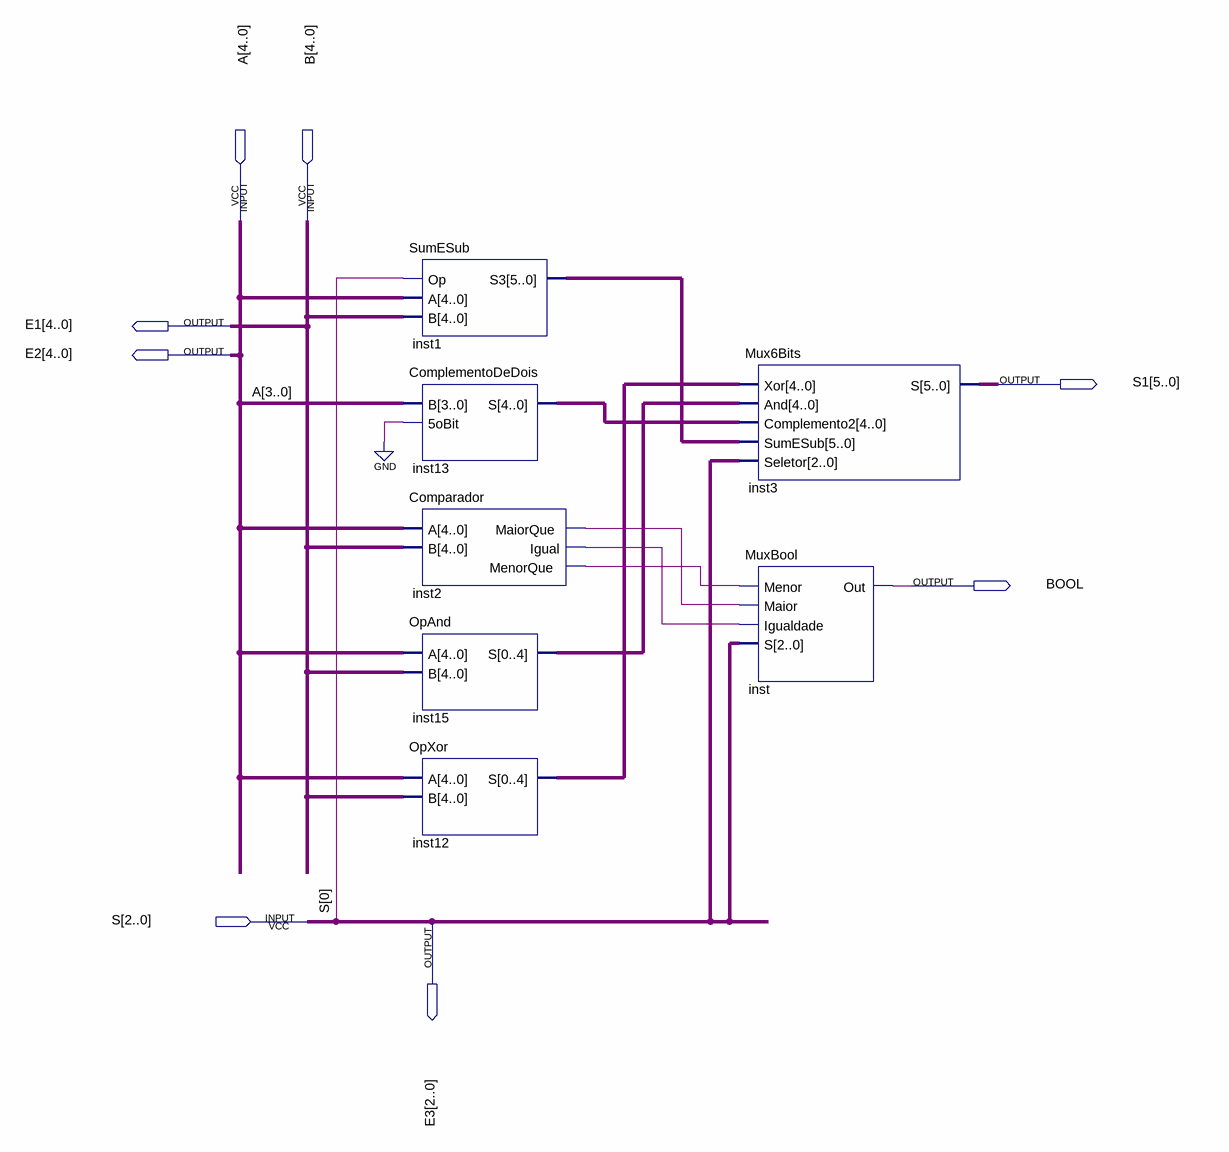
[diagram p0: schematic sheet]
// Quartus schematic Geral.bdf as structural Verilog: 7 symbols, 8 pins
module Geral (
  input  [4:0] A,
  input  [4:0] B,
  input  [2:0] S,
  output [4:0] E1,
  output [4:0] E2,
  output [5:0] S1,
  output BOOL,
  output [2:0] E3
);

  wire inst2_igual, inst2_maiorque, inst2_menorque;
  wire [4:0] inst12_s, inst13_s, inst15_s;
  wire [5:0] inst1_s3;

  SumESub inst1 (.Op(S[0]), .A(A), .B(B), .S3(inst1_s3));
  ComplementoDeDois inst13 (.B(A[3:0]), .\5oBit (1'b0), .S(inst13_s));
  Comparador inst2 (.A(A), .B(B), .MaiorQue(inst2_maiorque), .Igual(inst2_igual), .MenorQue(inst2_menorque));
  OpAnd inst15 (.A(A), .B(B), .S(inst15_s));
  OpXor inst12 (.A(A), .B(B), .S(inst12_s));
  Mux6Bits inst3 (.Xor(inst12_s), .And(inst15_s), .Complemento2(inst13_s), .SumESub(inst1_s3), .Seletor(S), .S(S1));
  MuxBool inst (.Menor(inst2_menorque), .Maior(inst2_maiorque), .Igualdade(inst2_igual), .S(S), .Out(BOOL));

  assign E1 = B;
  assign E2 = A;
  assign E3 = S;
endmodule
